# EAGLE design myPLA_Tester shield (EAGLE 9.6.2)
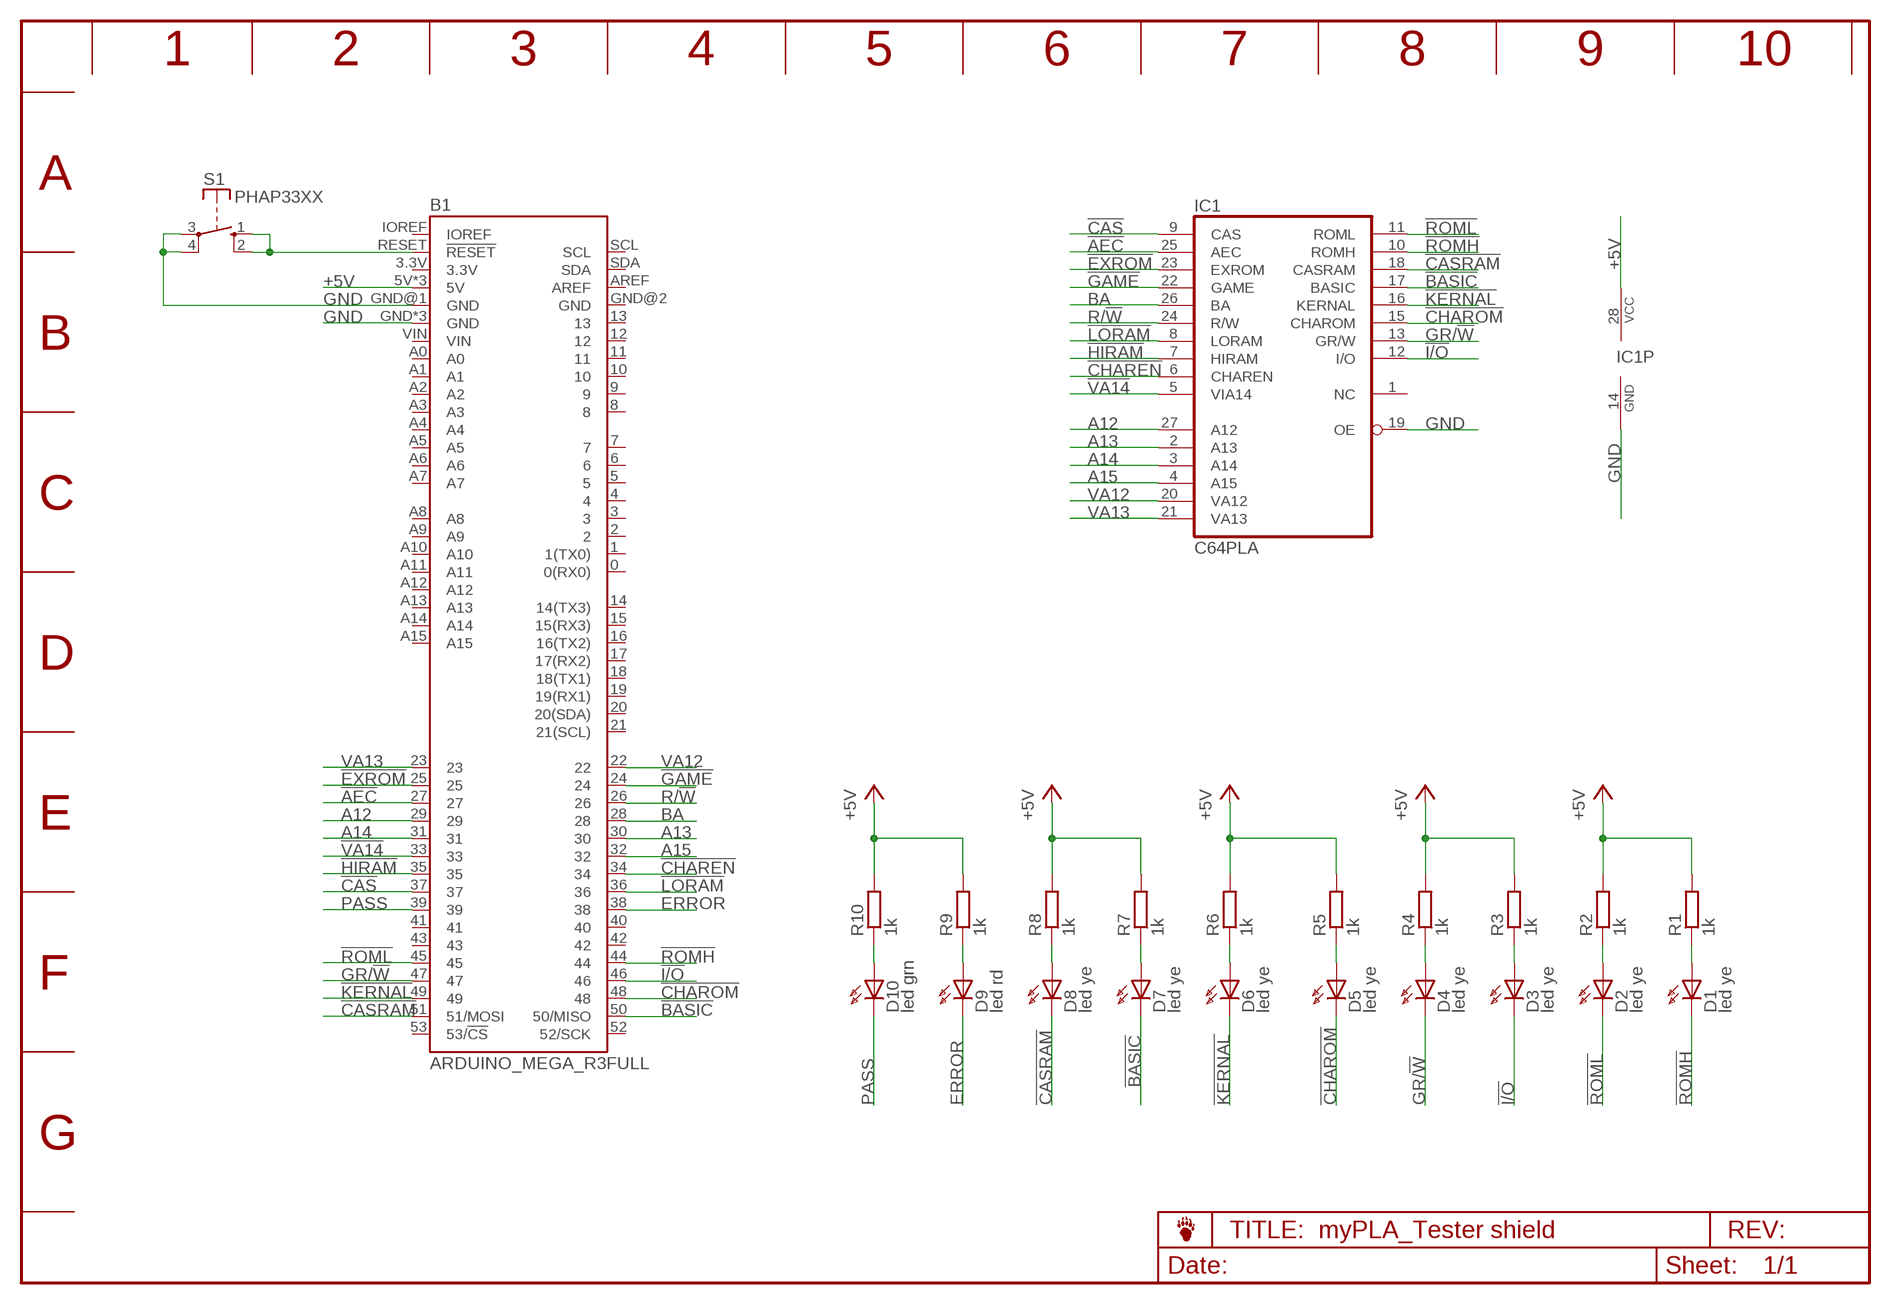
[diagram p0: schematic, sheet 1]

## Parts
B1  ARDUINO_MEGA_R3FULL  [ARDUINO_MEGA_NO_SILK]
D1  led ye  LED3MMS  [LED3MM]
D2  led ye  LED3MMS  [LED3MM]
D3  led ye  LED3MMS  [LED3MM]
D4  led ye  LED3MMS  [LED3MM]
D5  led ye  LED3MMS  [LED3MM]
D6  led ye  LED3MMS  [LED3MM]
D7  led ye  LED3MMS  [LED3MM]
D8  led ye  LED3MMS  [LED3MM]
D9  led rd  LED3MMS  [LED3MM]
D10  led grn  LED3MMS  [LED3MM]
IC1  C64PLA  [DIL28]
R1  1k  R-EU_0207/10  [0207/10]
R2  1k  R-EU_0207/10  [0207/10]
R3  1k  R-EU_0207/10  [0207/10]
R4  1k  R-EU_0207/10  [0207/10]
R5  1k  R-EU_0207/10  [0207/10]
R6  1k  R-EU_0207/10  [0207/10]
R7  1k  R-EU_0207/10  [0207/10]
R8  1k  R-EU_0207/10  [0207/10]
R9  1k  R-EU_0207/10  [0207/10]
R10  1k  R-EU_0207/10  [0207/10]
S1  PHAP33XX  [PHAP33XX]

## Nets
!AEC: B1.27 IC1.25(AEC)
!BASIC: B1.50(50/MISO) D7.K(C) IC1.17(BASIC)
!CAS: B1.37 IC1.9(CAS)
!CASRAM: B1.51(51/MOSI) D8.K(C) IC1.18(CASRAM)
!CHAREN: B1.34 IC1.6(CHAREN)
!CHAROM: B1.48 D5.K(C) IC1.15(CHAROM)
!EXROM: B1.25 IC1.23(EXROM)
!GAME: B1.24 IC1.22(GAME)
!HIRAM: B1.35 IC1.7(HIRAM)
!I/O: B1.46 D3.K(C) IC1.12(I/O)
!KERNAL: B1.49 D6.K(C) IC1.16(KERNAL)
!LORAM: B1.36 IC1.8(LORAM)
!ROMH: B1.44 D1.K(C) IC1.10(ROMH)
!ROML: B1.45 D2.K(C) IC1.11(ROML)
!VA14: B1.33 IC1.5(VIA14)
+5V: B1.5V B1.5V@1(5V) B1.5V@2(5V) IC1.28(VCC) R1.2 R2.2 R3.2 R4.2 R5.2 R6.2 R7.2 R8.2 R9.2 R10.2
A12: B1.29 IC1.27(A12)
A13: B1.30 IC1.2(A13)
A14: B1.31 IC1.3(A14)
A15: B1.32 IC1.4(A15)
BA: B1.28 IC1.26(BA)
ERROR: B1.38 D9.K(C)
GND: B1.GND B1.GND@1(GND) B1.GND@3(GND) B1.GND@4(GND) IC1.14(GND) IC1.19(OE) S1.3(P) S1.4(P)
GR/!W: B1.47 D4.K(C) IC1.13(GR/W)
N$1: D2.A R2.1
N$2: D1.A R1.1
N$3: D10.A R10.1
N$4: D9.A R9.1
N$9: D8.A R8.1
N$10: D7.A R7.1
N$17: D6.A R6.1
N$20: D5.A R5.1
N$24: D4.A R4.1
N$25: D3.A R3.1
N$32: B1.RESET(!RESET) S1.1(S) S1.2(S)
PASS: B1.39 D10.K(C)
R/!W: B1.26 IC1.24(R/W)
VA12: B1.22 IC1.20(VA12)
VA13: B1.23 IC1.21(VA13)
Unconnected: B1.0(0(RX0)) B1.1(1(TX0)) B1.2 B1.3 B1.3.3V B1.4 B1.5 B1.6 B1.7 B1.8 B1.9 B1.10 B1.11 B1.12 B1.13 B1.14(14(TX3)) B1.15(15(RX3)) B1.16(16(TX2)) B1.17(17(RX2)) B1.18(18(TX1)) B1.19(19(RX1)) B1.20(20(SDA)) B1.21(21(SCL)) B1.40 B1.41 B1.42 B1.43 B1.52(52/SCK) B1.53(53/!CS) B1.A0 B1.A1 B1.A2 B1.A3 B1.A4 B1.A5 B1.A6 B1.A7 B1.A8 B1.A9 B1.A10 B1.A11 B1.A12 B1.A13 B1.A14 B1.A15 B1.AREF B1.GND@2(GND) B1.IOREF B1.SCL B1.SDA B1.VIN IC1.1(NC)

## Library data of the parts
B1 = SparkFun-Boards:ARDUINO_MEGA_R3: Arduino Mega R3 ATmega2560 R3 compatible footprint. SparkFun Products: Arduino Mega 2560 R3 <https://www.sparkfun.com/products/11061>
D1-D10 = Led_bb:LED3MM: LED 3 mm, round
IC1 = 0RB_Commodore_bb:C64PLA: MEMORY
R1-R10 = rcl_bb:R-EU_: RESISTOR, European symbol
S1 = switch_bb:PHAP33XX

## Board
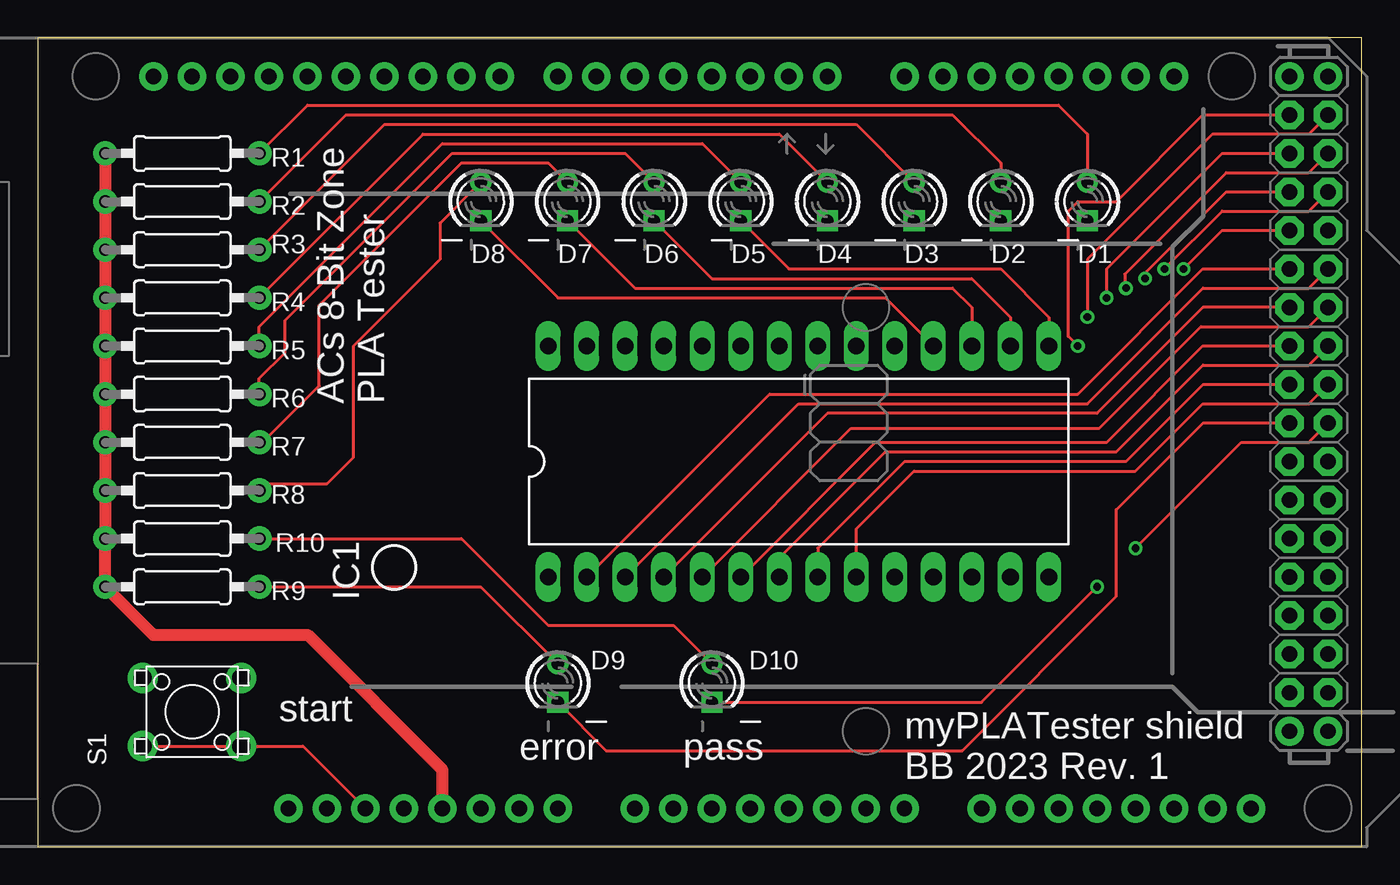
[diagram p1: board, top side]
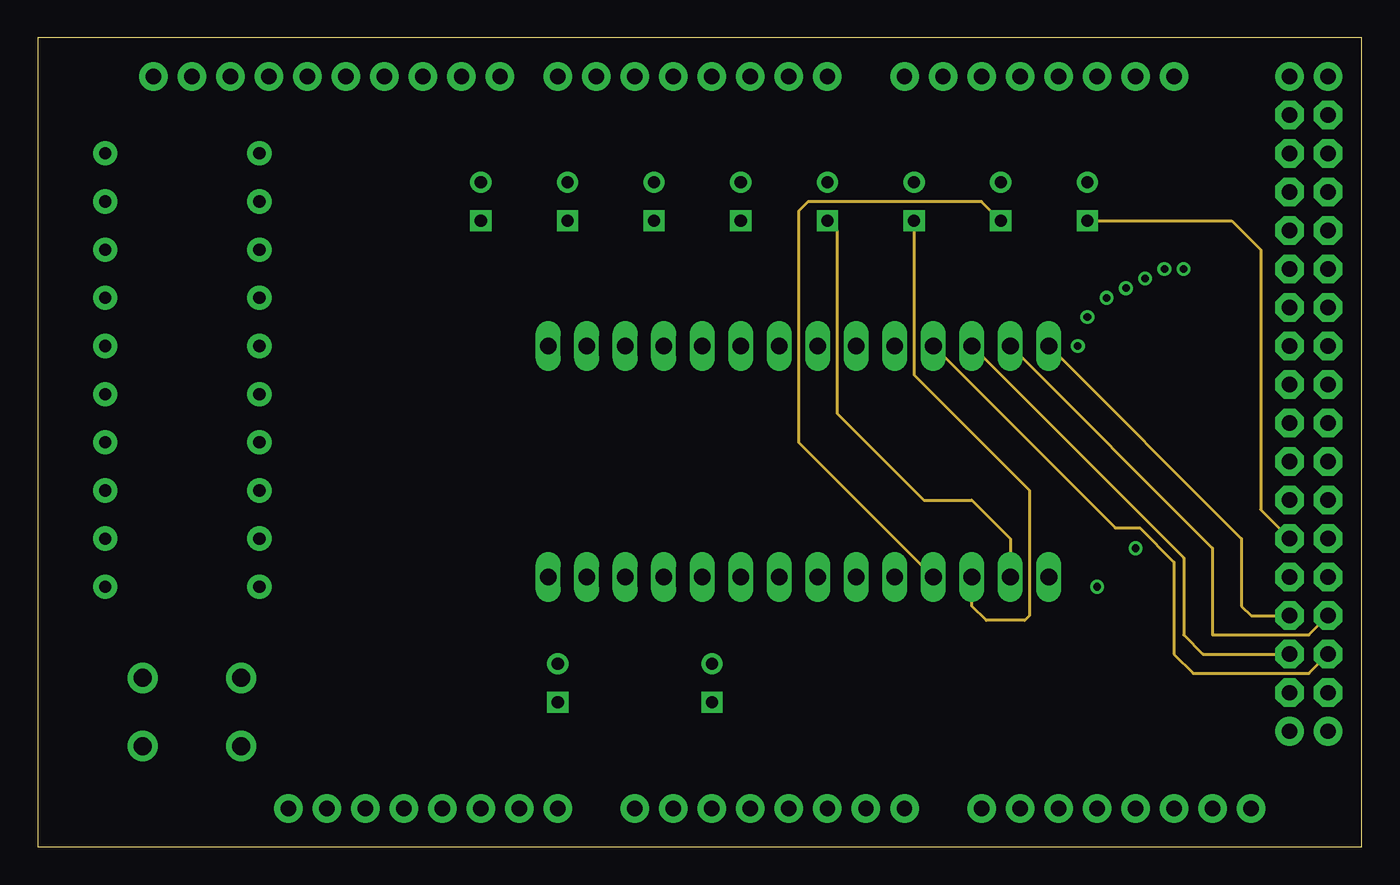
[diagram p2: board, inner layer Route2]
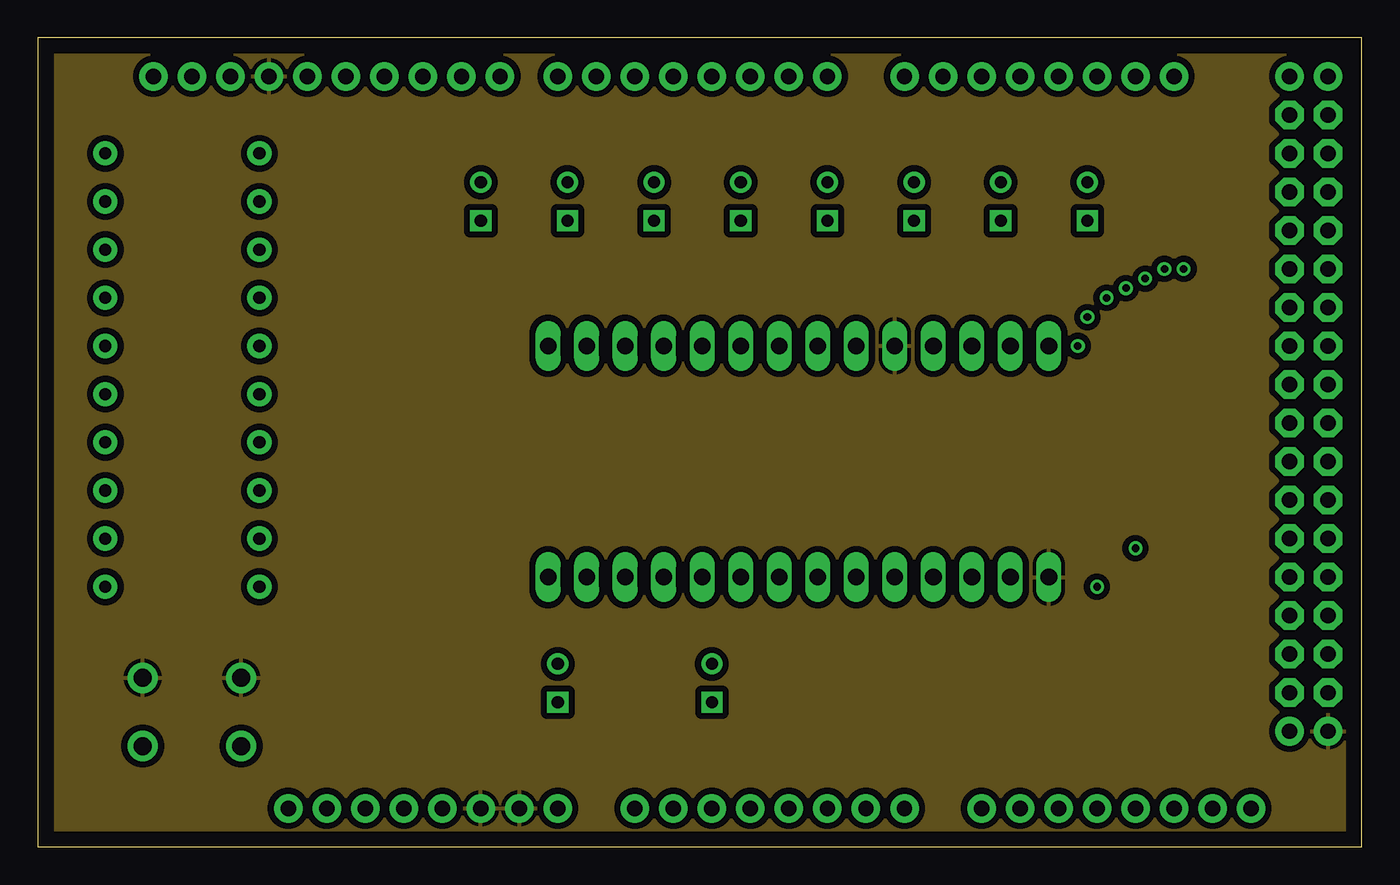
[diagram p3: board, inner layer Route15]
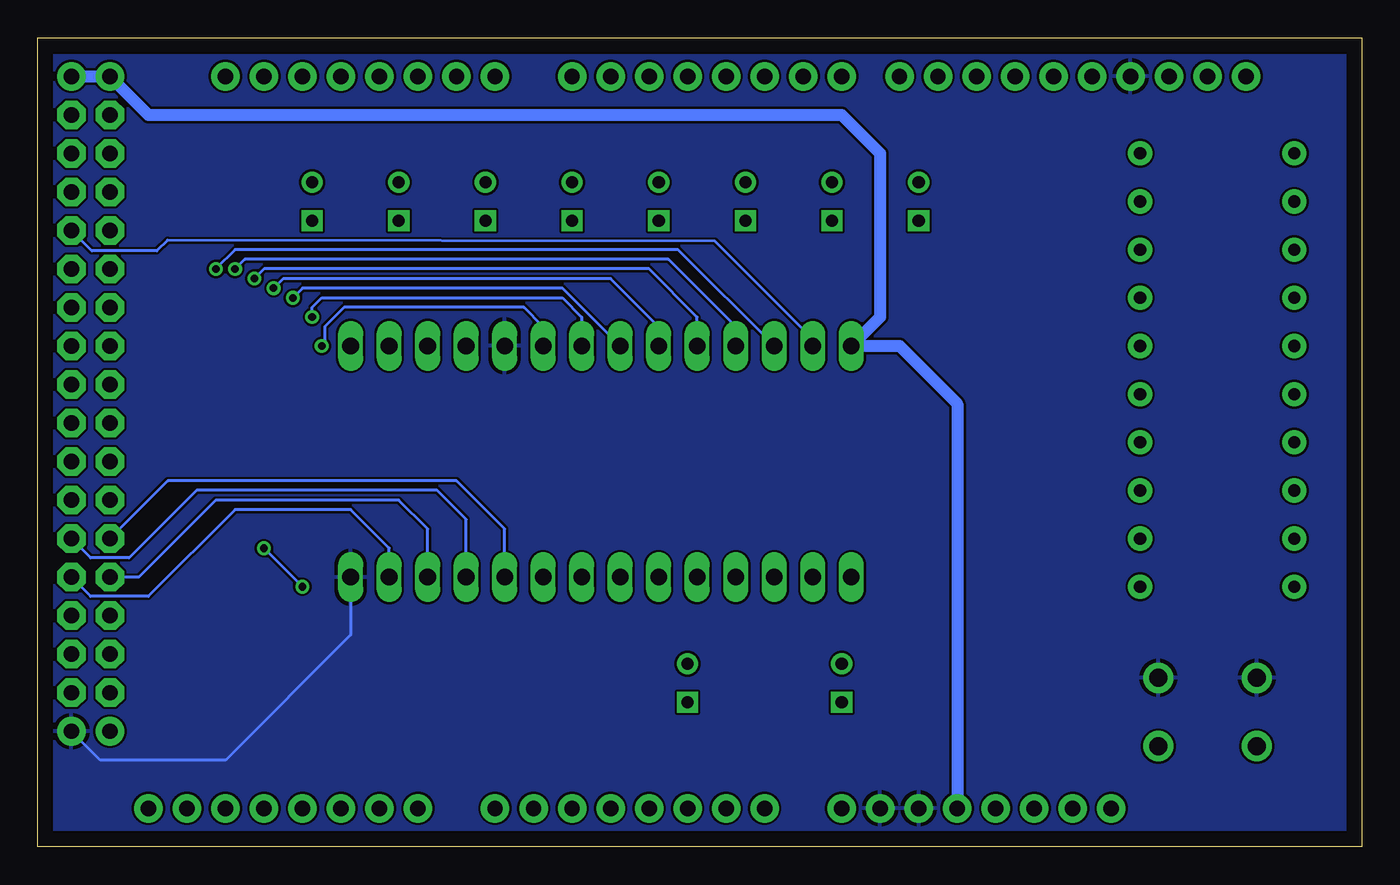
[diagram p4: board, bottom side, seen from below]

Size 87.3 x 53.33 mm. Coordinates in mm from the lower left corner, seen from the top.
Outline: 0,0 87.3,0 87.3,53.33 0,53.33 0,0
Copper layers (1*2+15*16): Top 0.035mm / dielectric 1.5mm / Route2 0.035mm / dielectric 0.15mm / Route15 0.035mm / dielectric 0.2mm / Bottom 0.035mm
Design rules "default *": minimum track width 6mil, minimum drill 0.35mm, track to track 6mil, track to pad 6mil, pad to pad 6mil, via to via 6mil, smd to smd 6mil, copper to edge 40mil, drill to drill 6mil, minimum pad ring 10mil, minimum via ring 8mil, stop-mask expansion 4mil, vias tented up to drill 0mil, thermal gap 10mil

### Footprints (pad centres in the part's own frame; a part is rotated, then mirrored left to right if it is on the bottom)
ARDUINO_MEGA_NO_SILK = drill 1.016 pad 1.88: 0 13.97,24.13; 1 11.43,24.13; 2 8.89,24.13; 3 6.35,24.13; 3.3V -13.97,-24.13; 4 3.81,24.13; 5 1.27,24.13; 5V -11.43,-24.13; 5V@1 44.45,24.13; 5V@2 46.99,24.13; 6 -1.27,24.13; 7 -3.81,24.13; 8 -7.62,24.13; 9 -10.16,24.13; 10 -12.7,24.13; 11 -15.24,24.13; 12 -17.78,24.13; 13 -20.32,24.13; 14 19.05,24.13; 15 21.59,24.13; 16 24.13,24.13; 17 26.67,24.13; 18 29.21,24.13; 19 31.75,24.13; 20 34.29,24.13; 21 36.83,24.13; A0 1.27,-24.13; A1 3.81,-24.13; A2 6.35,-24.13; A3 8.89,-24.13; A4 11.43,-24.13; A5 13.97,-24.13; A6 16.51,-24.13; A7 19.05,-24.13; A8 24.13,-24.13; A9 26.67,-24.13; A10 29.21,-24.13; A11 31.75,-24.13; A12 34.29,-24.13; A13 36.83,-24.13; A14 39.37,-24.13; A15 41.91,-24.13; AREF -25.4,24.13; GND -8.89,-24.13; GND@1 -6.35,-24.13; GND@2 44.45,-19.05; GND@3 46.99,-19.05; GND@4 -22.86,24.13; IOREF -19.05,-24.13; NC -21.59,-24.13; RESET -16.51,-24.13; SCL -30.48,24.13; SDA -27.94,24.13; VIN -3.81,-24.13 | drill 1.016 pad 1.88 octagon: 22 44.45,21.59; 23 46.99,21.59; 24 44.45,19.05; 25 46.99,19.05; 26 44.45,16.51; 27 46.99,16.51; 28 44.45,13.97; 29 46.99,13.97; 30 44.45,11.43; 31 46.99,11.43; 32 44.45,8.89; 33 46.99,8.89; 34 44.45,6.35; 35 46.99,6.35; 36 44.45,3.81; 37 46.99,3.81; 38 44.45,1.27; 39 46.99,1.27; 40 44.45,-1.27; 41 46.99,-1.27; 42 44.45,-3.81; 43 46.99,-3.81; 44 44.45,-6.35; 45 46.99,-6.35; 46 44.45,-8.89; 47 46.99,-8.89; 48 44.45,-11.43; 49 46.99,-11.43; 50 44.45,-13.97; 51 46.99,-13.97; 52 44.45,-16.51; 53 46.99,-16.51
LED3MM = drill 0.8 pad 1.4: A -1.27,0 | drill 0.8 pad 1.4 square: K 1.27,0
DIL28 = drill 1.1 long: 1 -16.51,-7.62; 2 -13.97,-7.62; 3 -11.43,-7.62; 4 -8.89,-7.62; 5 -6.35,-7.62; 6 -3.81,-7.62; 7 -1.27,-7.62; 8 1.27,-7.62; 9 3.81,-7.62; 10 6.35,-7.62; 11 8.89,-7.62; 12 11.43,-7.62; 13 13.97,-7.62; 14 16.51,-7.62; 15 16.51,7.62; 16 13.97,7.62; 17 11.43,7.62; 18 8.89,7.62; 19 6.35,7.62; 20 3.81,7.62; 21 1.27,7.62; 22 -1.27,7.62; 23 -3.81,7.62; 24 -6.35,7.62; 25 -8.89,7.62; 26 -11.43,7.62; 27 -13.97,7.62; 28 -16.51,7.62
0207/10 = drill 0.8 pad 1.6: 1 -5.08,0; 2 5.08,0
PHAP33XX = drill 1.2 pad 2: 1 -2.25,-3.25; 2 -2.25,3.25; 3 2.25,-3.25; 4 2.25,3.25

### Placement (x,y rotation side)
B1  38.1,26.67 0 top
D1  69.22,42.55 270 top
D2  63.5,42.55 270 top
D3  57.78,42.55 270 top
D4  52.07,42.55 270 top
D5  46.35,42.55 270 top
D6  40.64,42.55 270 top
D7  34.92,42.55 270 top
D8  29.21,42.55 270 top
D9  34.29,10.79 270 top
D10  44.45,10.79 270 top
IC1  50.16,25.4 0 top
R1  9.53,45.72 180 top
R2  9.53,42.55 180 top
R3  9.53,39.37 180 top
R4  9.53,36.2 180 top
R5  9.53,33.02 180 top
R6  9.53,29.84 180 top
R7  9.53,26.67 180 top
R8  9.53,23.5 180 top
R9  9.53,17.14 180 top
R10  9.53,20.32 180 top
S1  10.16,8.89 90 top

### Tracks (layer width: path | path; a pad name or v marks a point on that pad's centre or on a via)
!AEC  (via drill 0.5 pad 0.9)
  Top 0.2: v74.3,38.1 78.11,41.91 83.82,41.91 B1.27
  Bottom 0.2: IC1.25 41.27,34.29 45.72,38.73 73.66,38.73 v74.3,38.1
!BASIC
  Top 0.2: D7.K 39.37,36.83 60.33,36.83 61.59,35.56 IC1.17
  Route2 0.2: IC1.17 75.56,19.05 75.56,13.97 76.83,12.7 B1.50
!CAS
  Top 0.2: IC1.9 53.98,20.95 57.78,24.77 72.39,24.77 76.83,29.21 83.82,29.21 B1.37
!CASRAM
  Top 0.2: D8.K 34.29,36.2 55.88,36.2 IC1.18
  Route2 0.2: IC1.18 71.05,21.03 72.68,21.03 74.93,18.78 74.93,12.7 76.2,11.43 83.82,11.43 B1.51
!CHAREN
  Top 0.2: IC1.6 55.24,26.67 70.48,26.67 76.83,33.02 B1.34
!CHAROM
  Top 0.2: D5.K 49.53,38.1 63.5,38.1 66.67,34.92 IC1.15
  Route2 0.2: IC1.15 79.38,20.32 79.38,15.88 80.01,15.24 B1.48
!EXROM  (via drill 0.5 pad 0.9)
  Top 0.2: v71.75,36.83 71.68,36.9 71.68,37.76 78.38,44.45 83.82,44.45 B1.25
  Bottom 0.2: IC1.23 46.35,34.29 49.53,37.47 71.12,37.47 v71.75,36.83
!GAME  (via drill 0.5 pad 0.9)
  Top 0.2: v70.48,36.2 70.48,38.1 78.11,45.72 B1.24
  Bottom 0.2: IC1.22 52.7,36.83 69.85,36.83 v70.48,36.2
!HIRAM
  Top 0.2: IC1.7 48.9,19.05 55.88,26.04 71.12,26.04 76.83,31.75 83.82,31.75 B1.35
!I/O
  Route2 0.2: D3.K 57.78,31.11 65.41,23.5 65.41,15.24 65.09,14.92 62.55,14.92 61.59,15.88 IC1.12
  Bottom 0.2: IC1.12 61.59,20.95 63.5,22.86 75.56,22.86 80.64,17.78 B1.46
!KERNAL
  Top 0.2: D6.K 44.45,37.47 61.59,37.47 64.14,34.92 IC1.16
  Route2 0.2: IC1.16 77.47,19.68 77.47,13.97 83.82,13.97 B1.49
!LORAM
  Top 0.2: B1.36 76.83,30.48 71.75,25.4 57.15,25.4 51.44,19.68 IC1.8
!ROMH
  Route2 0.2: D1.K 78.74,41.27 80.64,39.37 80.64,22.23 B1.44
  Bottom 0.2: IC1.10 56.52,20.95 59.69,24.13 78.74,24.13 B1.44
!ROML
  Route2 0.2: D2.K 62.23,42.55 50.8,42.55 50.16,41.91 50.16,26.67 IC1.11
  Bottom 0.2: IC1.11 59.05,21.59 60.96,23.5 76.83,23.5 81.28,19.05 83.82,19.05 B1.45
!VA14
  Top 0.2: B1.33 83.82,34.29 76.7,34.29 70,27.59 53.62,27.59 IC1.5
+5V
  Top 0.8: B1.5V 26.67,5.08 17.78,13.97 7.62,13.97 R9.2 R10.2 R1.2 R2.2 R3.2 R4.2 R5.2 R6.2 R7.2 R8.2
  Bottom 0.8: B1.5V 26.67,29.21 30.48,33.02 IC1.28 31.75,34.92 31.75,45.72 34.29,48.26 80.01,48.26 B1.5V@1 B1.5V@2
A12
  Bottom 0.2: IC1.27 36.2,33.46 42.66,39.93 78.74,40 79.45,39.29 83.74,39.29 B1.29
A13
  Top 0.2: IC1.2 48.26,29.84 68.58,29.84 76.83,38.1 B1.30
A14
  Top 0.2: IC1.3 50.16,29.21 69.22,29.21 76.83,36.83 83.82,36.83 B1.31
A15
  Top 0.2: B1.32 76.83,35.56 69.85,28.57 52.07,28.57 IC1.4
BA  (via drill 0.5 pad 0.9)
  Top 0.2: v75.56,38.1 78.11,40.64 B1.28
  Bottom 0.2: IC1.26 45.09,39.37 74.3,39.37 v75.56,38.1
ERROR
  Top 0.2: B1.38 76.83,27.94 71.12,22.23 71.12,16.51 60.96,6.35 37.47,6.35 D9.K
GND
  Bottom 0.2: IC1.14 66.67,13.97 74.93,5.71 83.19,5.71 B1.GND@3
  pour Bottom: 0.64,52.7 87,52.7 87,0.64 0.64,0.64
  pour Route15 (isolate 0.406): 0.64,52.7 87,52.7 87,0.64 0.64,0.64
GR/!W
  Route2 0.2: D4.K 52.7,40.64 52.7,28.57 58.42,22.86 61.59,22.86 64.14,20.32 IC1.13
  Bottom 0.2: IC1.13 64.14,19.68 66.67,22.23 74.3,22.23 80.01,16.51 83.82,16.51 B1.47
N$1
  Top 0.2: R2.1 20.32,48.26 60.33,48.26 63.5,45.09 D2.A
N$2
  Top 0.2: R1.1 17.78,48.9 67.31,48.9 69.22,46.99 D1.A
N$3
  Top 0.2: R10.1 27.94,20.32 33.66,14.61 41.91,14.61 D10.A
N$4
  Top 0.2: R9.1 29.21,17.14 D9.A
N$9
  Top 0.2: D8.A 26.52,41.13 26.52,38.73 20.81,33.02 20.81,25.67 19.05,23.91 15.02,23.91 R8.1
N$10
  Top 0.2: R7.1 14.82,26.67 18.55,30.4 18.55,35.7 27.94,45.09 33.66,45.09 D7.A
N$17
  Top 0.2: R6.1 14.61,30.9 16.29,32.58 16.29,34.71 27.3,45.72 38.73,45.72 D6.A
N$20
  Top 0.2: R5.1 14.61,34.29 26.67,46.35 43.81,46.35 D5.A
N$24
  Top 0.2: R4.1 25.4,46.99 48.9,46.99 D4.A
N$25
  Top 0.2: R3.1 22.86,47.62 53.98,47.62 D3.A
N$32
  Top 0.2: S1.2 S1.1 17.49,6.64 B1.RESET
PASS  (via drill 0.5 pad 0.9)
  Top 0.2: D10.K 62.23,9.53 v69.85,17.14 | v72.39,19.68 79.38,26.67 83.82,26.67 B1.39
  Bottom 0.2: v69.85,17.14 v72.39,19.68
R/!W  (via drill 0.5 pad 0.9)
  Top 0.2: v73.03,37.47 72.95,37.54 72.95,37.76 78.38,43.18 B1.26
  Bottom 0.2: IC1.24 43.81,34.92 46.99,38.1 72.39,38.1 v73.03,37.47
VA12  (via drill 0.5 pad 0.9)
  Top 0.2: v68.58,33.02 67.94,33.66 67.94,41.91 68.58,42.55 71.12,42.55 76.83,48.26 B1.22
  Bottom 0.2: IC1.20 53.98,34.29 55.24,35.56 67.12,35.56 68.39,34.29 68.39,33.21 v68.58,33.02
VA13  (via drill 0.5 pad 0.9)
  Top 0.2: B1.23 83.82,46.99 77.47,46.99 69.22,38.73 v69.22,34.92
  Bottom 0.2: v69.22,34.92 69.22,35.56 68.58,36.2 52.7,36.2 51.44,34.92 IC1.21

### Text on the board
tNames: ACs 8-Bit Zone / PLA Tester | start | error | pass | myPLATester shield / BB 2023 Rev. 1